# Altium project riglab_dynamic_scales_wifi_3ch.PrjPcb (part 2 of 2)

## Sheet ADC.SchDoc: riglab_dynamic_scales_wifi_3ch
size 420 x 297 mm; DocumentNumber: 3; SheetNumber: 3; SheetTotal: 5; Обозначение_Код: RIG-00.00.001 Э3
Used 3 times, as channels ADC0, ADC1, ADC2. Parts and nets are listed once, with the designators drawn on the sheet.
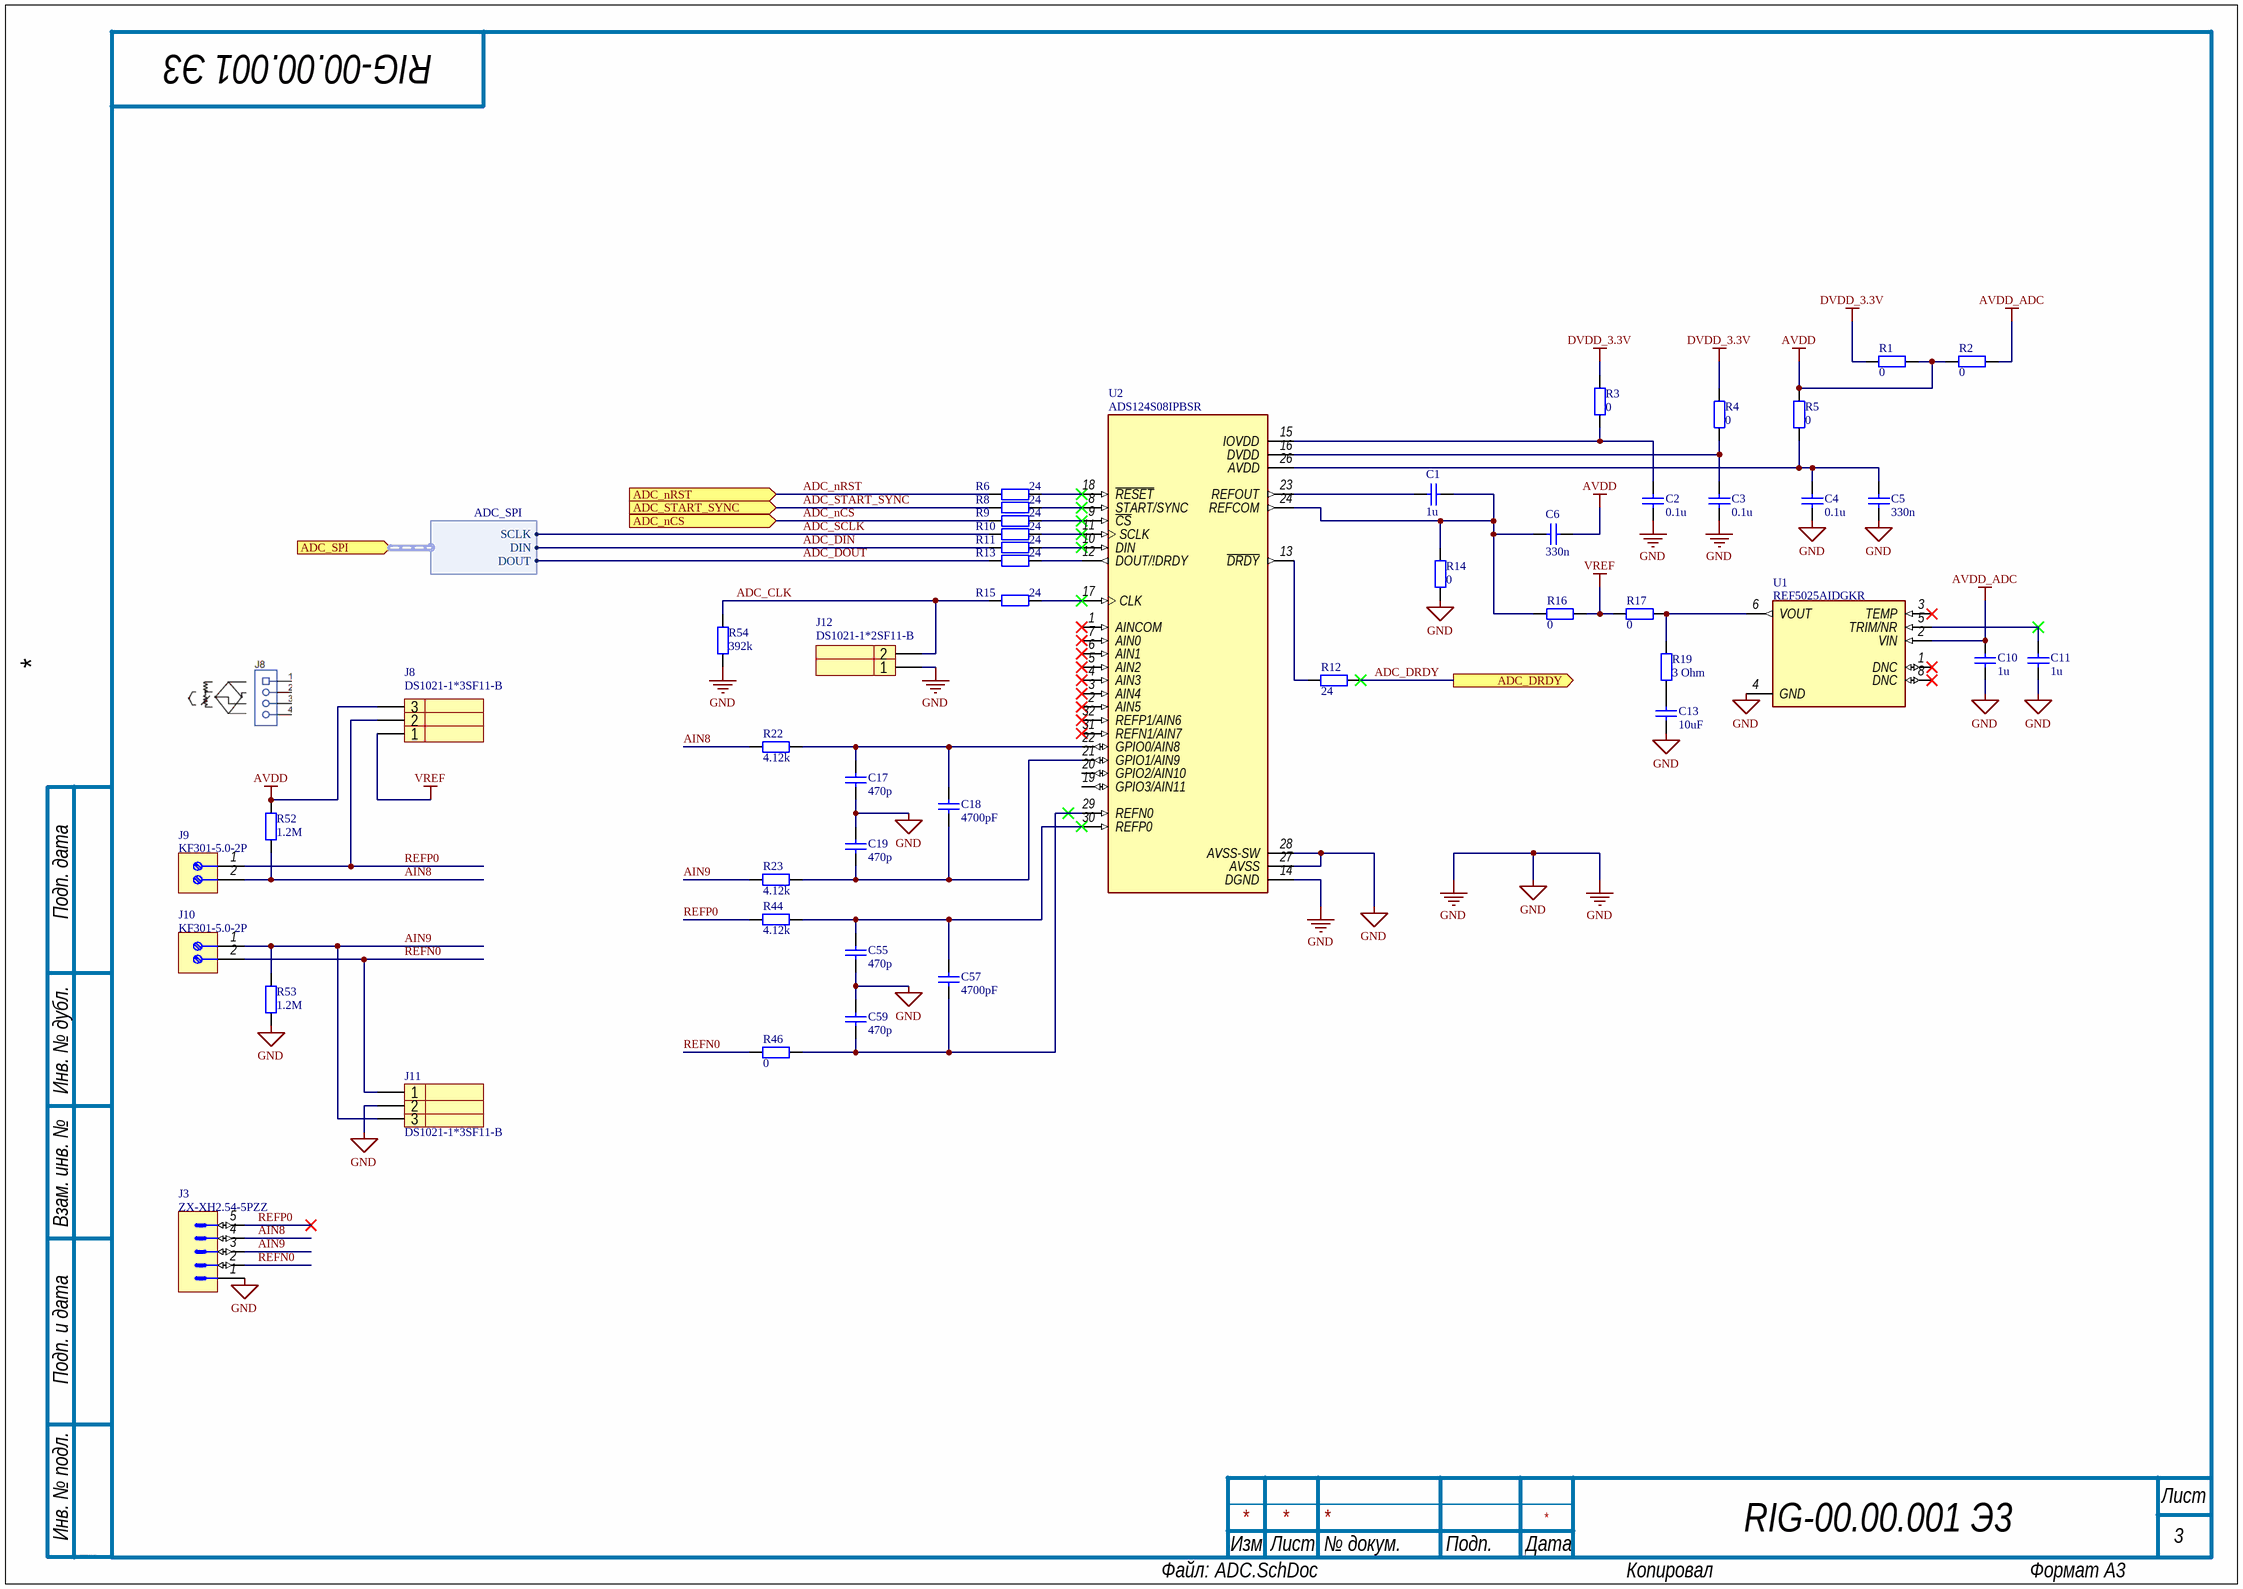
[diagram p4: ADC.SchDoc]

### Parts
C1  1u  [CAPC1608X85N]
C2  0.1u  [CAPC1005X55N]
C3  0.1u  [CAPC1005X55N]
C4  0.1u  [CAPC1005X55N]
C5  330n  [CAPC1608X85N]
C6  330n  [CAPC1608X85N]
C10  1u  [CAPC1608X85N]
C11  1u  [CAPC1608X85N]
C13  10uF  [CAPC2012X135N]
C17  470p  [CAPC1005X55N]
C18  4700pF  [CAPC1005X55N]
C19  470p  [CAPC1005X55N]
C55  470p  [CAPC1005X55N]
C57  4700pF  [CAPC1005X55N]
C59  470p  [CAPC1005X55N]
J3  ZX-XH2.54-5PZZ  [XH2.54-5PZZ]
J8  DS1021-1*3SF11-B  [PLS-3]
J9  KF301-5.0-2P  [CONN-TH_P5.00_KF301-5.0-2P]
J10  KF301-5.0-2P  [CONN-TH_P5.00_KF301-5.0-2P]
J11  DS1021-1*3SF11-B  [PLS-3]
J12  DS1021-1*2SF11-B  [PLS-2]
R1  0  [RESC1608X50N]
R2  0  [RESC1608X50N]
R3  0  [RESC1608X50N]
R4  0  [RESC1608X50N]
R5  0  [RESC1608X50N]
R6  24  [RESC1608X50N]
R8  24  [RESC1608X50N]
R9  24  [RESC1608X50N]
R10  24  [RESC1608X50N]
R11  24  [RESC1608X50N]
R12  24  [RESC1608X50N]
R13  24  [RESC1608X50N]
R14  0  [RESC1608X50N]
R15  24  [RESC1608X50N]
R16  0  [RESC1608X50N]
R17  0  [RESC1608X50N]
R19  3 Ohm  [RESC1608X50N]
R22  4.12k  [RESC1608X50N]
R23  4.12k  [RESC1608X50N]
R44  4.12k  [RESC1608X50N]
R46  0  [RESC1608X50N]
R52  1.2M  [RESC1608X50N]
R53  1.2M  [RESC1608X50N]
R54  392k  [RESC1005X40N]
U1  REF5025AIDGKR  [SOP65P490X110-8N_2]
U2  ADS124S08IPBSR  [QFP50P700X700X120-32N]

### Ports
ADC_DRDY (out), ADC_nCS (in), ADC_nRST (in), ADC_SPI (in, harness ADC_SPI), ADC_START_SYNC (in)

### Harnesses
ADC_SPI: DIN, DOUT, SCLK

### Nets
AVDD: C6.2 J8.3 R1.1 R2.2 R5.2 R52.2
AVDD_ADC: C10.1 R2.1 U1.2(VIN)
DVDD_3.3V: R1.2 R3.2 R4.2
GND: C2.1 C3.1 C4.1 C5.1 C10.2 C11.2 C13.1 C17.1 C19.2 C55.1 C59.2 J3.1 J11.2 J12.1 R14.1 R53.1 R54.1 U1.4(GND) U2.14(DGND) U2.27(AVSS) U2.28(AVSS-SW)
VREF: J8.1 R16.1 R17.2
ADC_CLK: J12.2 R15.1 R54.2
ADC_DIN: R11.1 ; port ADC_SPI.DIN
ADC_DOUT: R13.1 ; port ADC_SPI.DOUT
ADC_DRDY: R12.2 ; port ADC_DRDY
ADC_nCS: R9.1 ; port ADC_nCS
ADC_nRST: R6.1 ; port ADC_nRST
ADC_SCLK: R10.1 ; port ADC_SPI.SCLK
ADC_START_SYNC: R8.1 ; port ADC_START_SYNC
AIN8: J3.4 J9.2 R22.1 R52.1
AIN9: J3.3 J10.1 J11.3 R23.1 R53.2
REFN0: J3.2 J10.2 J11.1 R46.1
REFP0: J3.5 J8.2 J9.1 R44.1
NetC1_1: C1.1 C6.1 R14.2 R16.2 U2.24(REFCOM)
NetC1_2: C1.2 U2.23(REFOUT)
NetC2_2: C2.2 R3.1 U2.15(IOVDD)
NetC3_2: C3.2 R4.1 U2.16(DVDD)
NetC4_2: C4.2 C5.2 R5.1 U2.26(AVDD)
NetC11_1: C11.1 U1.5(TRIM/NR)
NetC13_2: C13.2 R19.1
NetC17_2: C17.2 C18.2 R22.2 U2.22(GPIO0/AIN8)
NetC18_1: C18.1 C19.1 R23.2 U2.21(GPIO1/AIN9)
NetC55_2: C55.2 C57.2 R44.2 U2.30(REFP0)
NetC57_1: C57.1 C59.1 R46.2 U2.29(REFN0)
NetR6_2: R6.2 U2.18(~{RESET})
NetR8_2: R8.2 U2.8(START/SYNC)
NetR9_2: R9.2 U2.9(~{CS})
NetR10_2: R10.2 U2.11(SCLK)
NetR11_2: R11.2 U2.10(DIN)
NetR12_1: R12.1 U2.13(~{DRDY})
NetR13_2: R13.2 U2.12(DOUT/!DRDY)
NetR15_2: R15.2 U2.17(CLK)
NetR17_1: R17.1 R19.2 U1.6(VOUT)

Not connected (* = marked no-connect by the designer): U1 1(DNC)* 3(TEMP)* 8(DNC)*; U2 1(AINCOM)* 2(AIN5)* 3(AIN4)* 4(AIN3)* 5(AIN2)* 6(AIN1)* 7(AIN0)* 19(GPIO3/AIN11) 20(GPIO2/AIN10) 31(REFN1/AIN7)* 32(REFP1/AIN6)*

### Channels
ADC0: designators end in A; ports ADC_DRDY=ADC0_DRDY ADC_nCS=ADC0_nCS ADC_nRST=ADC_nRST ADC_START_SYNC=ADC_START_SYNC
ADC1: designators end in B; ports ADC_DRDY=ADC1_DRDY ADC_nCS=ADC1_nCS ADC_nRST=ADC_nRST ADC_START_SYNC=ADC_START_SYNC
ADC2: designators end in C; ports ADC_DRDY=ADC2_DRDY ADC_nCS=ADC2_nCS ADC_nRST=ADC_nRST ADC_START_SYNC=ADC_START_SYNC

### Notes on the sheet
- Подп. дата
- Инв. № дубл.
- Взам. инв. №
- Подп. и дата
- Инв. № подл.
- Изм.
- Лист
- № докум.
- Подп.
- Дата
- ALTIUM GOSTBOM2.0 KEV
- Файл:
- Копировал
- Формат А3

### Library data of the parts
C1 C10 C11 = CC0603KRX7R9BB105: CAP CER 0603 1u 50V X7R; Manufacturer: Yageo; ID: 12; Device: 0603; Tolerance: 10%; Type: Resistor; Packaging Type: Cut Tape; Working Temperature Min: -55°С; Working Temperature Max: +125°С; Table: Capacitor SMT - Керамические; Part Number: CC0603KRX7R9BB105; Value: 1u; Voltage: 50V; Dielectric Type: X7R; Series: CC; SMD: Yes; Manufacturer Part Number: CC0603KRX7R9BB105; Datasheet URL: #https://www.terraelectronica.ru/pdf/show?pdf_file=http%253A%252F%252Fwww.mouser.com%252Fds%252F2%252F447%252FUPY-GPHC_X7R_6.3V-to-50V_18-1154002.pdf#; Status: Active; Price: 0; Price2: 0; Price3: 0; Author: Krepak V.; CreateDate: 06.04.2020
C2-C4 = CL05B104KO5NNNC: CAP CER 0402 0.1u 16V X7R; Manufacturer: Samsung Electro-Mechanics; ID: 57; Device: 0402; Tolerance: 10%; Type: Resistor; Packaging Type: Tape&Reel; Working Temperature Min: -55°С; Working Temperature Max: +125°С; Table: Capacitor SMT - Керамические; Part Number: CL05B104KO5NNNC; Value: 0.1u; Voltage: 16V; Dielectric Type: X7R; Series: CL; SMD: Yes; Manufacturer Part Number: CL05B104KO5NNNC; Datasheet URL: #https://media.digikey.com/pdf/Data%20Sheets/Samsung%20PDFs/CL05B104KO5NNNC.pdf#; Status: Active; Price: 0; Price2: 0; Price3: 0; Author: Krepak V.; CreateDate: 22.06.2021; Supplier 1: Digikey; Supplier Part Number 1: 1276-1001-2-ND
C5 C6 = C1608X7R1H334K080AC: CAP CER 0603 330n 50V X7R; Manufacturer: Yageo; ID: 16; Device: 0603; Tolerance: 10%; Type: Resistor; Packaging Type: Cut Tape; Working Temperature Min: -55°С; Working Temperature Max: +125°С; Table: Capacitor SMT - Керамические; Part Number: C1608X7R1H334K080AC; Value: 330n; Voltage: 50V; Dielectric Type: X7R; Series: C; SMD: Yes; Manufacturer Part Number: C1608X7R1H334K080AC; Datasheet URL: #https://www.terraelectronica.ru/pdf/show?pdf_file=http%253A%252F%252Fwww.farnell.com%252Fdatasheets%252F1913358.pdf#; Status: Active; Price: 0; Price2: 0; Price3: 0; Author: Krepak V.; CreateDate: 06.07.2020
C13 = GRM21BR61E106KA73L: CAP CER 0805 10uF 25V X5R; Manufacturer: Murata; ID: 20; Device: 0805; Tolerance: 10%; Type: Resistor; Packaging Type: Cut Tape; Working Temperature Min: -55°С; Working Temperature Max: +125°С; Table: Capacitor SMT - Керамические; Part Number: GRM21BR61E106KA73L; Value: 10uF; Voltage: 25V; Dielectric Type: X5R; Series: GRM; SMD: Yes; Manufacturer Part Number: GRM21BR61E106KA73L; Datasheet URL: #https://www.terraelectronica.ru/pdf/show?pdf_file=http%253A%252F%252Fwww.farnell.com%252Fdatasheets%252F2047963.pdf#; Status: Active; Price: 0; Price2: 0; Price3: 0; Author: Arshanitsa D.; CreateDate: 17.08.2020
C17 C19 C55 C59 = CC0402JRX7R9BB471: CAP CER 0402 470p 50V X7R; Manufacturer: Yageo; ID: 11; Device: 0402; Tolerance: 5%; Type: Resistor; Packaging Type: Cut Tape; Working Temperature Min: -55°С; Working Temperature Max: +125°С; Table: Capacitor SMT - Керамические; Part Number: CC0402JRX7R9BB471; Value: 470p; Voltage: 50V; Dielectric Type: X7R; Series: CC; SMD: Yes; Manufacturer Part Number: CC0402JRX7R9BB471; Datasheet URL: #https://www.terraelectronica.ru/pdf/show?pdf_file=%252Fds%252Fpdf%252FX%252FX7R_16V-to-100V.pdf#; Status: Active; Price: 0; Price2: 0; Price3: 0; Author: Krepak V.; CreateDate: 05.04.2020
C18 C57 = CC0402KRX7R9BB472: CAP CER 0402 4700pF 50V X7R; Manufacturer: Yageo; ID: 70; Device: 0402; Tolerance: ±10%; Type: Resistor; Packaging Type: Tape&Reel; Working Temperature Min: -55°С; Working Temperature Max: +125°С; Table: Capacitor SMT - Керамические; Part Number: CC0402KRX7R9BB472; Value: 4700pF; Voltage: 50V; Dielectric Type: X7R; Series: CC; SMD: Yes; Manufacturer Part Number: CC0402KRX7R9BB472; Status: Active; Price: 0; Price2: 0; Price3: 0; Author: Krepak V.; CreateDate: 09.04.2024
J3 = ZX-XH2.54-5PZZ: 1x5P XH 1 2.54mm Tin Male pin 5 260℃ -25℃~+85℃ Brass 3A Straight Plugin,P=2.54mm Wire To Board / Wire To Wire Connector ROHS; ID: 50; Table: Connectors - Общ; Part Number: ZX-XH2.54-5PZZ; Device: ZX-XH2.54-5PZZ; Type: Connector; SMD: No; Status: Active; Price: 0; Price2: 0; Price3: 0; Author: Krepak V.; CreateDate: 09.04.2024
J8 J11 = DS1021-1*3SF11-B: Manufacturer: CONNFLY; ID: 13; Limit Voltage: 500 V AC(1 min); Resistance: 20 mOhm(max); Pitch: 2.54mm; Working Temperature Min: -20°С; Working Temperature Max: +70°С; Table: Connectors - Общ; Part Number: DS1021-1*3SF11-B; Device: PLS-3; Pins: 3; Type: Connector; SMD: No; Datasheet URL: #https://static.chipdip.ru/lib/227/DOC000227157.pdf#; Status: Active; Price: 0; Price2: 0; Price3: 0; Author: Arshanitsa D.; CreateDate: 19.08.2020
J9 J10 = KF301-5.0-2P: 1x2P -30℃~+120℃ 17A 250V Blue 14~22 Straight 5mm 1.5 1 2 Plugin,P=5mm Screw terminal ROHS; Manufacturer: Cixi Kefa Elec; ID: 47; Working Temperature Min: -30°С; Working Temperature Max: +120°С; Table: Connectors - Общ; Part Number: KF301-5.0-2P; Device: KF301-5.0-2P; Limit Voltage: 250V; Limit Current: 17A; Type: Connector; SMD: No; Datasheet URL: #https://jlcpcb.com/partdetail/Cixi_KefaElec-KF301_5_02P/C474881#; Status: Active; Price: 0; Price2: 0; Price3: 0; Author: Krepak V.; CreateDate: 19.02.2024
J12 = DS1021-1*2SF11-B: Manufacturer: CONNFLY; ID: 14; Limit Voltage: 500 V AC(1 min); Resistance: 20 mOhm(max); Pitch: 2.54mm; Working Temperature Min: -20°С; Working Temperature Max: +70°С; Table: Connectors - Общ; Part Number: DS1021-1*2SF11-B; Device: PLS-2; Pins: 2; Type: Connector; SMD: No; Datasheet URL: #https://static.chipdip.ru/lib/227/DOC000227157.pdf#; Status: Active; Price: 0; Price2: 0; Price3: 0; Author: Arshanitsa D.; CreateDate: 19.08.2020
R1-R5 R14 R16 R17 R46 = RC0603JR-070RL: RES 0603 0 5%; Manufacturer: Yageo; ID: 25; Device: 0603; Limit Voltage: 50V; Temperature Coefficient: 100ppm; Total Power Dissipation: 0.063W; Packaging Type: Cut Tape; Library Ref 2: Resistor2; Library Ref 3: Resistor3; Library Path 2: Resistors.SchLib; Application Category: 1; Working Temperature Min: -55°С; Working Temperature Max: +155°С; Table: Resistor SMT - Постоянные; Part Number: RC0603JR-070RL; Value: 0; Tolerance: 5%; Series: RC; Type: Resistor; Material: Thick-Film; SMD: Yes; Manufacturer Part Number: RC0603JR-070RL; Datasheet URL: #https://static.chipdip.ru/lib/788/DOC004788200.pdf#; Status: Active; Price: 0; Price2: 0; Price3: 0; Author: Arshanitsa D.; CreateDate: 28.06.2020
R6 R8-R13 R15 = RC0603JR-0724RL: RES 0603 24 5%; Manufacturer: Yageo; ID: 40; Device: 0603; Limit Voltage: 75V; Temperature Coefficient: 100ppm; Total Power Dissipation: 0.1W; Packaging Type: Cut Tape; Replacement: CR0603-JW-240ELF; Library Ref 2: Resistor2; Library Ref 3: Resistor3; Library Path 2: Resistors.SchLib; Application Category: 1; Working Temperature Min: -55°С; Working Temperature Max: +155°С; Table: Resistor SMT - Постоянные; Part Number: RC0603JR-0724RL; Value: 24; Tolerance: 5%; Series: RC; Type: Resistor; Material: Thick-Film; SMD: Yes; Manufacturer Part Number: RC0603JR-0724RL; Datasheet URL: #https://www.terraelectronica.ru/pdf/show?pdf_file=%252Fds%252Fpdf%252FR%252FRC0603%255B1%255D.pdf#; Status: Active; Distributor: terraelectronica; Price: 0; Price2: 0; Price3: 0; DistributorURL: #https://www.terraelectronica.ru/product/439264#; Author: Krepak V.; CreateDate: 06.07.2020
R19 = CRCW06033R00JNEA: RES 0603 3 Ohm 5%; Manufacturer: Vishay Dale; ID: 76; Device: 0603; Limit Voltage: 75V; Temperature Coefficient: 100ppm; Total Power Dissipation: 0.1W; Packaging Type: Tape&Reel; Library Ref 2: Resistor2; Library Ref 3: Resistor3; Library Path 2: Resistors.SchLib; Application Category: 1; Working Temperature Min: -55°С; Working Temperature Max: +155°С; Table: Resistor SMT - Постоянные; Part Number: CRCW06033R00JNEA; Value: 3 Ohm; Tolerance: 5%; Series: CRCW; Type: Resistor; Material: Thick-Film; SMD: Yes; Manufacturer Part Number: CRCW06033R00JNEA; Datasheet URL: #https://www.vishay.com/docs/20035/dcrcwe3.pdf#; Status: Active; Price: 0; Price2: 0; Price3: 0; Author: Krepak V.; CreateDate: 21.05.2021; Supplier 1: Digikey; Supplier Part Number 1: 541-3.0GTR-ND
R22 R23 R44 = RC0603BR-074K12L: RES 0603 4.12k 0.1%; Manufacturer: Yageo; ID: 110; Device: 0603; Limit Voltage: 75V; Temperature Coefficient: 100ppm; Total Power Dissipation: 0.1W; Packaging Type: Cut Tape; Library Ref 2: Resistor2; Library Ref 3: Resistor3; Library Path 2: Resistors.SchLib; Application Category: 1; Working Temperature Min: -55°С; Working Temperature Max: +155°С; Table: Resistor SMT - Постоянные; Part Number: RC0603BR-074K12L; Value: 4.12k; Tolerance: 0.1%; Series: RC; Type: Resistor; Material: Thick-Film; SMD: Yes; Manufacturer Part Number: RC0603BR-074K12L; Datasheet URL: #https://www.terraelectronica.ru/pdf/show?pdf_file=https%253A%252F%252Fwww.mouser.com%252Fds%252F2%252F447%252FRC0603-1212058.pdf#; Status: Active; Distributor: terraelectronica; Price: 0; Price2: 0; Price3: 0; DistributorURL: #https://www.terraelectronica.ru/product/871213#; Author: Krepak V.; CreateDate: 09.04.2024
R52 R53 = RC0603FR-071M2L: RES 0603 1.2M 1%; Manufacturer: Yageo; ID: 97; Device: 0603; Limit Voltage: 75V; Temperature Coefficient: 100ppm; Total Power Dissipation: 0.1W; Packaging Type: Cut Tape; Library Ref 2: Resistor2; Library Ref 3: Resistor3; Library Path 2: Resistors.SchLib; Application Category: 1; Working Temperature Min: -55°С; Working Temperature Max: +155°С; Table: Resistor SMT - Постоянные; Part Number: RC0603FR-071M2L; Value: 1.2M; Tolerance: 1%; Series: RC; Type: Resistor; Material: Thick-Film; SMD: Yes; Manufacturer Part Number: RC0603FR-071M2L; Status: Active; Price: 0; Price2: 0; Price3: 0; Author: Krepak V.; CreateDate: 28.03.2023
R54 = RC0402FR-07392KL: RES 0402 392k 1%; Manufacturer: Yageo; ID: 84; Device: 0402; Limit Voltage: 50V; Temperature Coefficient: 100ppm; Total Power Dissipation: 0.0625W; Packaging Type: Tape&Reel; Library Ref 2: Resistor2; Library Ref 3: Resistor3; Library Path 2: Resistors.SchLib; Application Category: 1; Working Temperature Min: -55°С; Working Temperature Max: +155°С; Table: Resistor SMT - Постоянные; Part Number: RC0402FR-07392KL; Value: 392k; Tolerance: 1%; Series: RC_L; Type: Resistor; Material: Thick-Film; SMD: Yes; Manufacturer Part Number: RC0402FR-07392KL; Datasheet URL: #https://www.yageo.com/upload/media/product/productsearch/datasheet/rchip/PYu-RC_Group_51_RoHS_L_11.pdf#; Status: Active; Distributor2: Jul. 7, 2020 V.11; Price: 0; Price2: 0; Price3: 0; Author: Krepak V.; CreateDate: 24.06.2021; Supplier 1: Digikey; Supplier Part Number 1: YAG3144TR-ND
U1 = REF5025AIDGKR: Series Voltage Reference IC Fixed 2.5V V ±0.1% 10 mA 8-VSSOP; Manufacturer: Texas Instruments; ID: 2; Input Voltage: 2.7V ~ 18V; Output Current: 10 mA; Packaging Type: Tape&Reel; Working Temperature Min: -40°C; Working Temperature Max: +125°C (TA); Table: IC - Разное; Package: None; Price: 0; MP: REF5025AIDGKR; Availability: Unavailable; Part Number: REF5025AIDGKR; Device: REF5025; Output Voltage (Min/Fixed): 2.5V; Output Type: Fixed; Tolerance: ±0.1%; Type: IC; Manufacturer Part Number: REF5025AIDGKR; Datasheet URL: #https://www.ti.com/lit/ds/symlink/ref5020.pdf#; Datasheet Version: SBOS410K – JUNE 2007 – REVISED JUNE 2023; Status: Active; Price2: 0; Price3: 0; Author: Krepak V.; CreateDate: 04.04.2024
U2 = ADS124S08IPBSR: 24 Bit Analog to Digital Converter 12 Input 1 Sigma-Delta 32-TQFP (5x5); MF: Texas Instruments; ID: 11; Input Voltage: Analog 2.7V ~ 5.25V Digital 2.7V ~ 3.6V; Function: ADC; Packaging Type: Tape&Reel; Working Temperature Min: -50°C; Working Temperature Max: +125°С; Table: IC - Разное; Availability: Unavailable; Package: LQFP-32 Texas Instruments; SnapEDA_Link: https://www.snapeda.com/parts/ADS124S08IPBSR/Texas%20Instruments/view-part/584788/?ref=snap; Price: 0; MP: ADS124S08IPBSR; Part Number: ADS124S08IPBSR; Device: ADS124S08IPBSR; Type: IC; SMD: Yes; Manufacturer: Texas Instruments; Manufacturer Part Number: ADS124S08IPBSR; Datasheet URL: #https://www.ti.com/lit/gpn/ADS124S08#; Datasheet Version: SBAS660C –AUGUST 2016–REVISED JUNE 2017; Status: Active; Price2: 0; Price3: 0; Author: Krepak V.; CreateDate: 04.04.2024

## Nets that join several sheets
AVDD: ADC0 (6 pins), ADC1 (6 pins), ADC2 (6 pins)
AVDD_ADC: Power (6 pins), ADC0 (C10A.1 R2A.1 U1A.2), ADC1 (C10B.1 R2B.1 U1B.2), ADC2 (C10C.1 R2C.1 U1C.2)
DVDD_3.3V: Power (C73.2 U8.2), ADC0 (R1A.2 R3A.2 R4A.2), ADC1 (R1B.2 R3B.2 R4B.2), ADC2 (R1C.2 R3C.2 R4C.2)
GND: Main (J1.2 J6.2 J18.0 J18.5), Power (43 pins), MCU (36 pins), WiFi (13 pins), ADC0 (21 pins), ADC1 (21 pins), ADC2 (21 pins)
VBAT: Main (J1.1 J6.1), Power (7 pins)
VBUS: Main (J18.1), WiFi (D4.1)
VCC3V3: Power (C44.2 C45.2 U6.2), MCU (19 pins), WiFi (7 pins)
VCC5V0: Power (C40.2 C41.2 D3.1 U4.3), WiFi (C62.2 C63.2 D4.2 U10.16)
VREF: ADC0 (J8A.1 R16A.1 R17A.2), ADC1 (J8B.1 R16B.1 R17B.2), ADC2 (J8C.1 R16C.1 R17C.2)
ADC0_DRDY: MCU (U3.65), ADC0 (R12A.2)
ADC0_nCS: MCU (U3.54), ADC0 (R9A.1)
ADC1_DRDY: MCU (U3.93), ADC1 (R12B.2)
ADC1_nCS: MCU (U3.32), ADC1 (R9B.1)
ADC2_DRDY: MCU (U3.95), ADC2 (R12C.2)
ADC2_nCS: MCU (U3.33), ADC2 (R9C.1)
ADC_DIN: MCU (U3.16), ADC0 (R11A.1), ADC1 (R11B.1), ADC2 (R11C.1)
ADC_DOUT: MCU (U3.53), ADC0 (R13A.1), ADC1 (R13B.1), ADC2 (R13C.1)
ADC_nRST: MCU (U3.60), ADC0 (R6A.1), ADC1 (R6B.1), ADC2 (R6C.1)
ADC_SCLK: MCU (U3.68), ADC0 (R10A.1), ADC1 (R10B.1), ADC2 (R10C.1)
ADC_START_SYNC: MCU (U3.61), ADC0 (R8A.1), ADC1 (R8B.1), ADC2 (R8C.1)
D_N: Main (J18.2), WiFi (U10.6)
D_P: Main (J18.3), WiFi (U10.5)
ESP_CS0: MCU (U3.67), WiFi (R67.2 U9.16)
ESP_MISO: MCU (U3.30), WiFi (U9.6)
ESP_MOSI: MCU (U3.31), WiFi (U9.7)
ESP_SCLK: MCU (U3.89), WiFi (U9.5)

## Assembly variants
Basic: not fitted J9A J9B J9C J10A J10B J10C R1 R16 R32 R33 R35 R36 R41 R42 R74 R? R?